# Altium schematic sheet [08] - QSFP28_2.SchDoc: QSFP28 Module
size A3; Engineer: *ORCEL THYS; DocumentNumber: 5; SheetNumber: 5; SheetTotal: 14
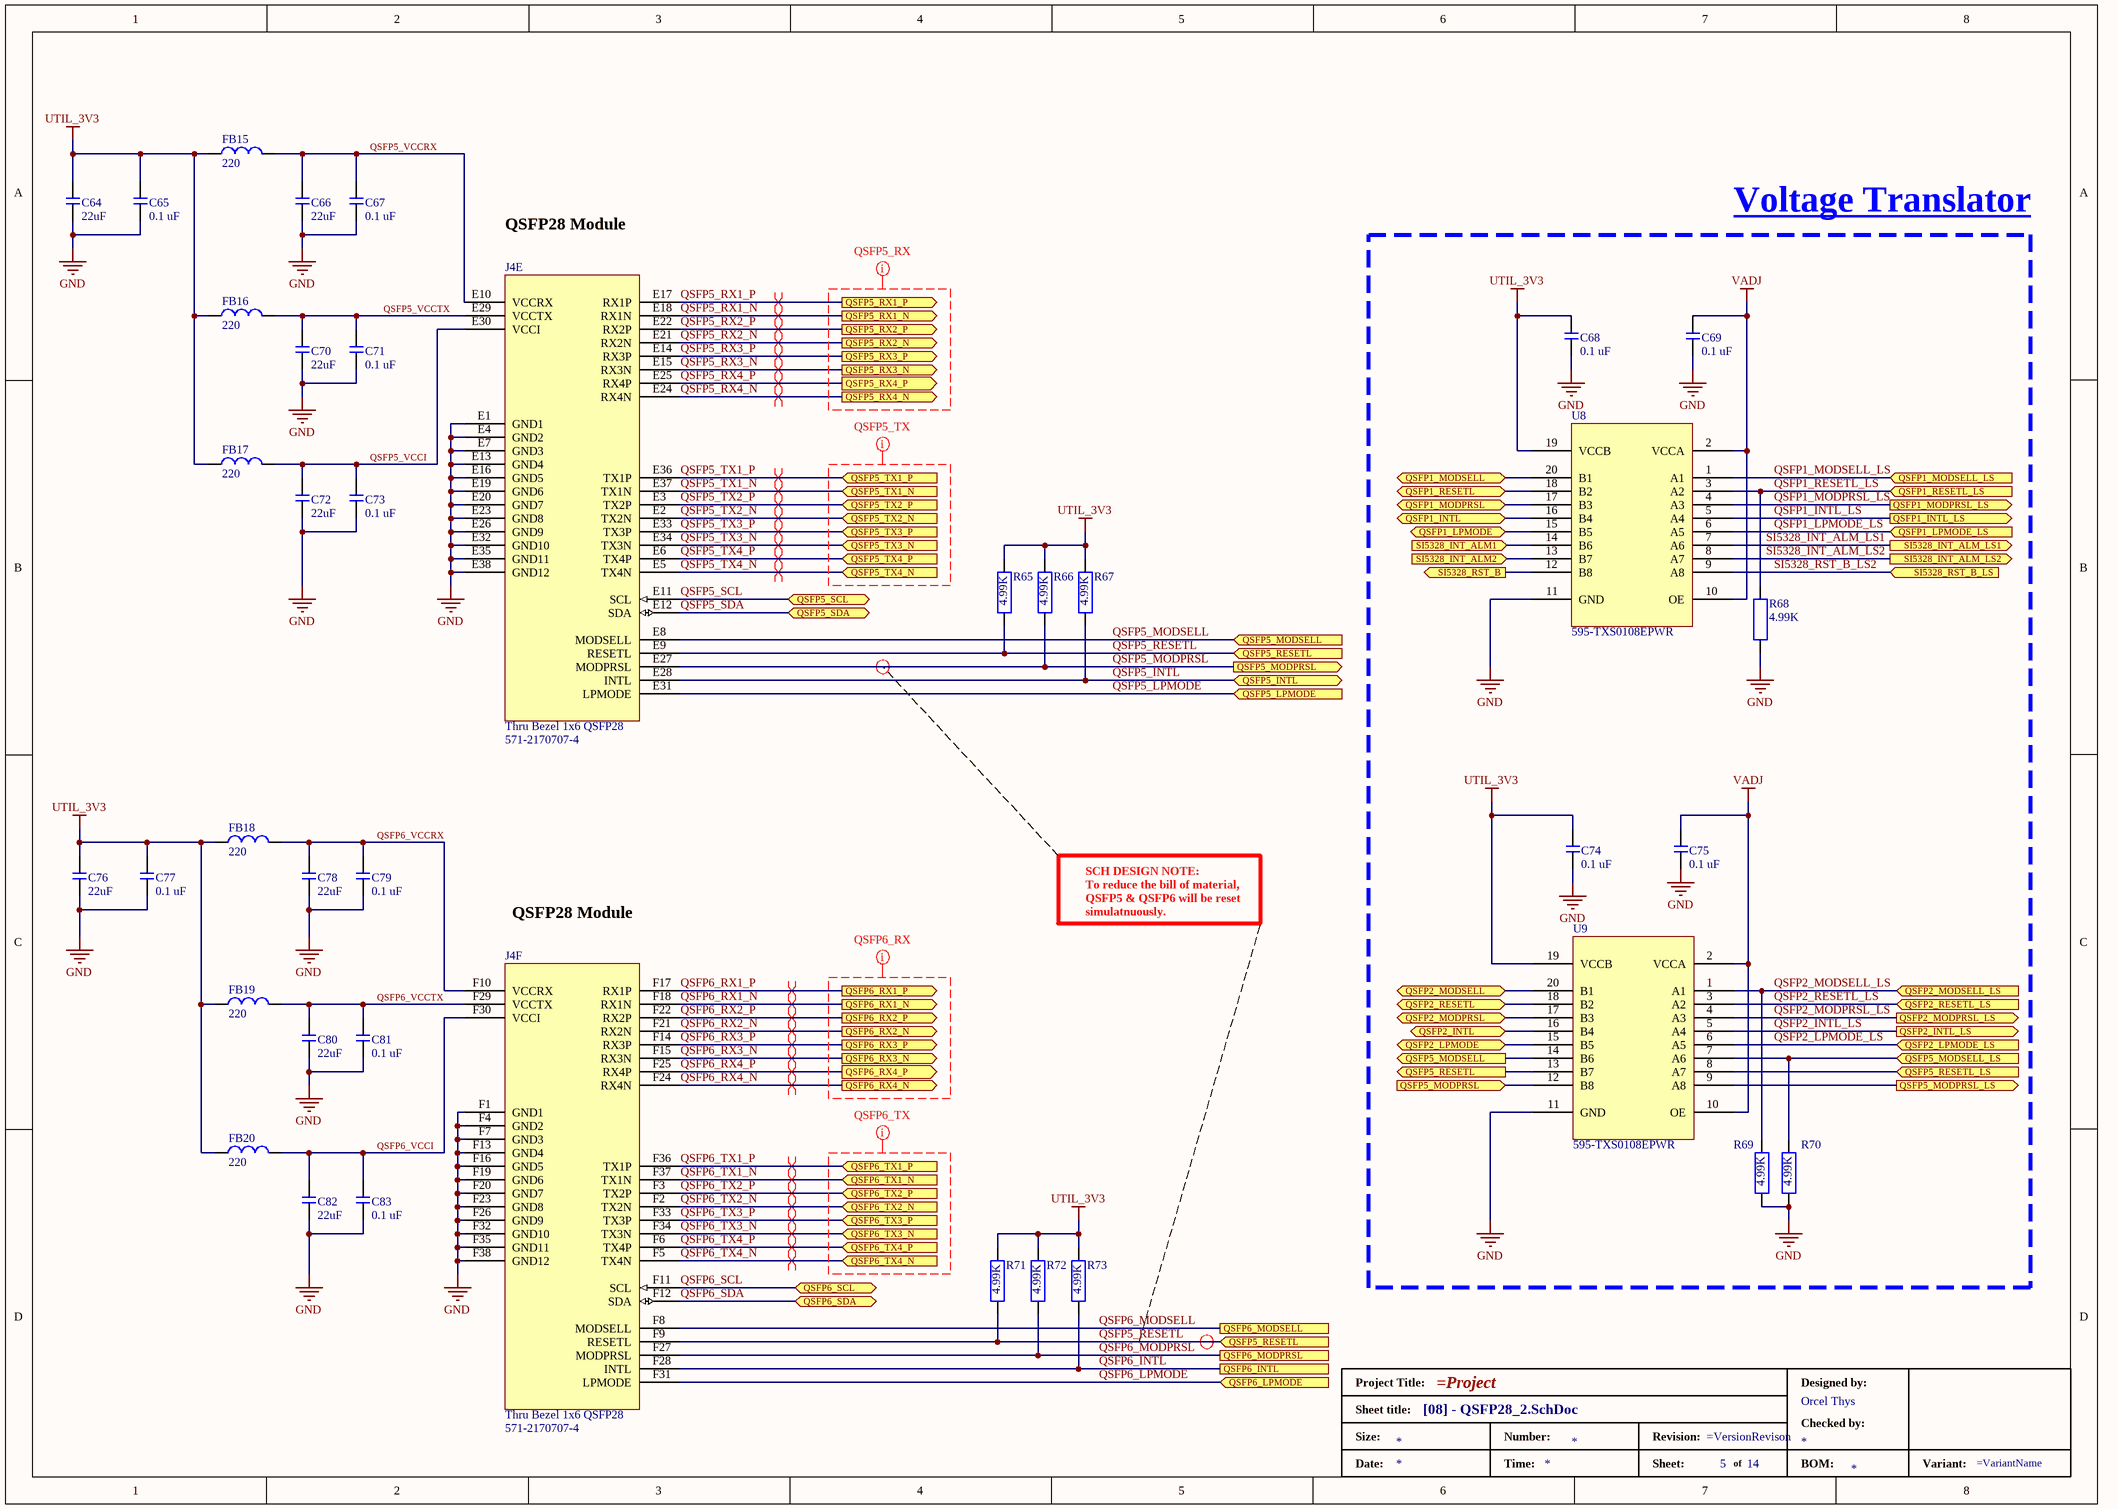
[diagram p0: [08] - QSFP28_2.SchDoc]

## Parts
*  DesignedBy: Orcel Thys  (hidden comment: Standard Title Block)  (graphical)
C64  22uF  [C2012]
C65  0.1 uF  [C0402]
C66  22uF  [C2012]
C67  0.1 uF  [C0402]
C68  0.1 uF  [C0402]
C69  0.1 uF  [C0402]
C70  22uF  [C2012]
C71  0.1 uF  [C0402]
C72  22uF  [C2012]
C73  0.1 uF  [C0402]
C74  0.1 uF  [C0402]
C75  0.1 uF  [C0402]
C76  22uF  [C2012]
C77  0.1 uF  [C0402]
C78  22uF  [C2012]
C79  0.1 uF  [C0402]
C80  22uF  [C2012]
C81  0.1 uF  [C0402]
C82  22uF  [C2012]
C83  0.1 uF  [C0402]
FB15  220  [BEADC1608X75N]
FB16  220  [BEADC1608X75N]
FB17  220  [BEADC1608X75N]
FB18  220  [BEADC1608X75N]
FB19  220  [BEADC1608X75N]
FB20  220  [BEADC1608X75N]
J4  Thru Bezel 1x6 QSFP28  Supplier Part Number 1: 571-2170707-4  [TE_2170707-4]  (parts E,F of 7)
R65  4.99K  [R0402]
R66  4.99K  [R0402]
R67  4.99K  [R0402]
R68  4.99K  [R0402]
R69  4.99K  [R0402]
R70  4.99K  [R0402]
R71  4.99K  [R0402]
R72  4.99K  [R0402]
R73  4.99K  [R0402]
U8  Supplier Part Number 1: 595-TXS0108EPWR  [SOP_65P640X120-20N]  (hidden comment: 8-bit voltage translator)
U9  Supplier Part Number 1: 595-TXS0108EPWR  [SOP_65P640X120-20N]  (hidden comment: 8-bit voltage translator)

## Blocks framed on the sheet
Voltage Translator: C68 C69 C74 C75 R68-R70 U8 U9

## Ports
QSFP1_INTL (bidir), QSFP1_INTL_LS (out), QSFP1_LPMODE (bidir), QSFP1_LPMODE_LS (in), QSFP1_MODPRSL (bidir), QSFP1_MODPRSL_LS (out), QSFP1_MODSELL (bidir), QSFP1_MODSELL_LS (in), QSFP1_RESETL (bidir), QSFP1_RESETL_LS (in), QSFP2_INTL (bidir), QSFP2_INTL_LS (out), QSFP2_LPMODE (bidir), QSFP2_LPMODE_LS (in), QSFP2_MODPRSL (bidir), QSFP2_MODPRSL_LS (out), QSFP2_MODSELL (bidir), QSFP2_MODSELL_LS (in), QSFP2_RESETL (bidir), QSFP2_RESETL_LS (in), QSFP5_INTL (bidir), QSFP5_LPMODE (in), QSFP5_MODPRSL (in), QSFP5_MODPRSL (out), QSFP5_MODPRSL_LS (out), QSFP5_MODSELL (in), QSFP5_MODSELL (out), QSFP5_MODSELL_LS (in), QSFP5_RESETL (in), QSFP5_RESETL (out), QSFP5_RESETL_LS (in), QSFP5_RX1_N (out), QSFP5_RX1_P (out), QSFP5_RX2_N (out), QSFP5_RX2_P (out), QSFP5_RX3_N (out), QSFP5_RX3_P (out), QSFP5_RX4_N (out), QSFP5_RX4_P (out), QSFP5_SCL (bidir), QSFP5_SDA (bidir), QSFP5_TX1_N (in), QSFP5_TX1_P (in), QSFP5_TX2_N (in), QSFP5_TX2_P (in), QSFP5_TX3_N (in), QSFP5_TX3_P (in), QSFP5_TX4_N (in), QSFP5_TX4_P (in), QSFP6_INTL, QSFP6_LPMODE (in), QSFP6_MODPRSL, QSFP6_MODSELL, QSFP6_RX1_N (out), QSFP6_RX1_P (out), QSFP6_RX2_N (out), QSFP6_RX2_P (out), QSFP6_RX3_N (out), QSFP6_RX3_P (out), QSFP6_RX4_N (out), QSFP6_RX4_P (out), QSFP6_SCL (bidir), QSFP6_SDA (bidir), QSFP6_TX1_N (in), QSFP6_TX1_P (in), QSFP6_TX2_N (in), QSFP6_TX2_P (in), QSFP6_TX3_N (in), QSFP6_TX3_P (in), QSFP6_TX4_N (in), QSFP6_TX4_P (in), SI5328_INT_ALM1 (in), SI5328_INT_ALM2 (in), SI5328_INT_ALM_LS1 (out), SI5328_INT_ALM_LS2 (out), SI5328_RST_B (out), SI5328_RST_B_LS (in)

## Nets
GND: C64.1 C65.1 C66.1 C67.1 C68.2 C69.1 C70.1 C71.1 C72.1 C73.1 C74.1 C75.1 C76.1 C77.1 C78.1 C79.1 C80.1 C81.1 C82.1 C83.1 J4.E1(GND1) J4.E4(GND2) J4.E7(GND3) J4.E13(GND4) J4.E16(GND5) J4.E19(GND6) J4.E20(GND7) J4.E23(GND8) J4.E26(GND9) J4.E32(GND10) J4.E35(GND11) J4.E38(GND12) J4.F1(GND1) J4.F4(GND2) J4.F7(GND3) J4.F13(GND4) J4.F16(GND5) J4.F19(GND6) J4.F20(GND7) J4.F23(GND8) J4.F26(GND9) J4.F32(GND10) J4.F35(GND11) J4.F38(GND12) R68.1 R69.1 R70.1 U8.11(GND) U9.11(GND)
UTIL_3V3: C64.2 C65.2 C68.1 C74.2 C76.2 C77.2 FB15.1 FB16.1 FB17.1 FB18.1 FB19.1 FB20.1 R65.2 R66.2 R67.2 R71.2 R72.2 R73.2 U8.19(VCCB) U9.19(VCCB)
VADJ: C69.2 C75.2 U8.2(VCCA) U8.10(OE) U9.2(VCCA) U9.10(OE)
QSFP1_INTL: U8.16(B4) ; port QSFP1_INTL
QSFP1_INTL_LS: U8.5(A4) ; port QSFP1_INTL_LS
QSFP1_LPMODE: U8.15(B5) ; port QSFP1_LPMODE
QSFP1_LPMODE_LS: U8.6(A5) ; port QSFP1_LPMODE_LS
QSFP1_MODPRSL: U8.17(B3) ; port QSFP1_MODPRSL
QSFP1_MODPRSL_LS: U8.4(A3) ; port QSFP1_MODPRSL_LS
QSFP1_MODSELL: U8.20(B1) ; port QSFP1_MODSELL
QSFP1_MODSELL_LS: U8.1(A1) ; port QSFP1_MODSELL_LS
QSFP1_RESETL: U8.18(B2) ; port QSFP1_RESETL
QSFP1_RESETL_LS: R68.2 U8.3(A2) ; port QSFP1_RESETL_LS
QSFP2_INTL: U9.16(B4) ; port QSFP2_INTL
QSFP2_INTL_LS: U9.5(A4) ; port QSFP2_INTL_LS
QSFP2_LPMODE: U9.15(B5) ; port QSFP2_LPMODE
QSFP2_LPMODE_LS: U9.6(A5) ; port QSFP2_LPMODE_LS
QSFP2_MODPRSL: U9.17(B3) ; port QSFP2_MODPRSL
QSFP2_MODPRSL_LS: U9.4(A3) ; port QSFP2_MODPRSL_LS
QSFP2_MODSELL: U9.20(B1) ; port QSFP2_MODSELL
QSFP2_MODSELL_LS: R69.2 U9.1(A1) ; port QSFP2_MODSELL_LS
QSFP2_RESETL: U9.18(B2) ; port QSFP2_RESETL
QSFP2_RESETL_LS: U9.3(A2) ; port QSFP2_RESETL_LS
QSFP5_INTL: J4.E28(INTL) R67.1 ; port QSFP5_INTL
QSFP5_LPMODE: J4.E31(LPMODE) ; port QSFP5_LPMODE
QSFP5_MODPRSL: J4.E27(MODPRSL) R66.1 U9.12(B8) ; port QSFP5_MODPRSL
QSFP5_MODPRSL_LS: U9.9(A8) ; port QSFP5_MODPRSL_LS
QSFP5_MODSELL: J4.E8(MODSELL) U9.14(B6) ; port QSFP5_MODSELL
QSFP5_MODSELL_LS: R70.2 U9.7(A6) ; port QSFP5_MODSELL_LS
QSFP5_RESETL: J4.E9(RESETL) J4.F9(RESETL) R65.1 R71.1 U9.13(B7) ; port QSFP5_RESETL
QSFP5_RESETL_LS: U9.8(A7) ; port QSFP5_RESETL_LS
QSFP5_RX1_N: J4.E18(RX1N) ; port QSFP5_RX1_N
QSFP5_RX1_P: J4.E17(RX1P) ; port QSFP5_RX1_P
QSFP5_RX2_N: J4.E21(RX2N) ; port QSFP5_RX2_N
QSFP5_RX2_P: J4.E22(RX2P) ; port QSFP5_RX2_P
QSFP5_RX3_N: J4.E15(RX3N) ; port QSFP5_RX3_N
QSFP5_RX3_P: J4.E14(RX3P) ; port QSFP5_RX3_P
QSFP5_RX4_N: J4.E24(RX4N) ; port QSFP5_RX4_N
QSFP5_RX4_P: J4.E25(RX4P) ; port QSFP5_RX4_P
QSFP5_SCL: J4.E11(SCL) ; port QSFP5_SCL
QSFP5_SDA: J4.E12(SDA) ; port QSFP5_SDA
QSFP5_TX1_N: J4.E37(TX1N) ; port QSFP5_TX1_N
QSFP5_TX1_P: J4.E36(TX1P) ; port QSFP5_TX1_P
QSFP5_TX2_N: J4.E2(TX2N) ; port QSFP5_TX2_N
QSFP5_TX2_P: J4.E3(TX2P) ; port QSFP5_TX2_P
QSFP5_TX3_N: J4.E34(TX3N) ; port QSFP5_TX3_N
QSFP5_TX3_P: J4.E33(TX3P) ; port QSFP5_TX3_P
QSFP5_TX4_N: J4.E5(TX4N) ; port QSFP5_TX4_N
QSFP5_TX4_P: J4.E6(TX4P) ; port QSFP5_TX4_P
QSFP5_VCCI: C72.2 C73.2 FB17.2 J4.E30(VCCI)
QSFP5_VCCRX: C66.2 C67.2 FB15.2 J4.E10(VCCRX)
QSFP5_VCCTX: C70.2 C71.2 FB16.2 J4.E29(VCCTX)
QSFP6_INTL: J4.F28(INTL) R73.1 ; port QSFP6_INTL
QSFP6_LPMODE: J4.F31(LPMODE) ; port QSFP6_LPMODE
QSFP6_MODPRSL: J4.F27(MODPRSL) R72.1 ; port QSFP6_MODPRSL
QSFP6_MODSELL: J4.F8(MODSELL) ; port QSFP6_MODSELL
QSFP6_RX1_N: J4.F18(RX1N) ; port QSFP6_RX1_N
QSFP6_RX1_P: J4.F17(RX1P) ; port QSFP6_RX1_P
QSFP6_RX2_N: J4.F21(RX2N) ; port QSFP6_RX2_N
QSFP6_RX2_P: J4.F22(RX2P) ; port QSFP6_RX2_P
QSFP6_RX3_N: J4.F15(RX3N) ; port QSFP6_RX3_N
QSFP6_RX3_P: J4.F14(RX3P) ; port QSFP6_RX3_P
QSFP6_RX4_N: J4.F24(RX4N) ; port QSFP6_RX4_N
QSFP6_RX4_P: J4.F25(RX4P) ; port QSFP6_RX4_P
QSFP6_SCL: J4.F11(SCL) ; port QSFP6_SCL
QSFP6_SDA: J4.F12(SDA) ; port QSFP6_SDA
QSFP6_TX1_N: J4.F37(TX1N) ; port QSFP6_TX1_N
QSFP6_TX1_P: J4.F36(TX1P) ; port QSFP6_TX1_P
QSFP6_TX2_N: J4.F2(TX2N) ; port QSFP6_TX2_N
QSFP6_TX2_P: J4.F3(TX2P) ; port QSFP6_TX2_P
QSFP6_TX3_N: J4.F34(TX3N) ; port QSFP6_TX3_N
QSFP6_TX3_P: J4.F33(TX3P) ; port QSFP6_TX3_P
QSFP6_TX4_N: J4.F5(TX4N) ; port QSFP6_TX4_N
QSFP6_TX4_P: J4.F6(TX4P) ; port QSFP6_TX4_P
QSFP6_VCCI: C82.2 C83.2 FB20.2 J4.F30(VCCI)
QSFP6_VCCRX: C78.2 C79.2 FB18.2 J4.F10(VCCRX)
QSFP6_VCCTX: C80.2 C81.2 FB19.2 J4.F29(VCCTX)
SI5328_INT_ALM1: U8.14(B6) ; port SI5328_INT_ALM1
SI5328_INT_ALM2: U8.13(B7) ; port SI5328_INT_ALM2
SI5328_INT_ALM_LS1: U8.7(A6) ; port SI5328_INT_ALM_LS1
SI5328_INT_ALM_LS2: U8.8(A7) ; port SI5328_INT_ALM_LS2
SI5328_RST_B: U8.12(B8) ; port SI5328_RST_B
SI5328_RST_B_LS2: U8.9(A8) ; port SI5328_RST_B_LS

## Layout directives
mark named QSFP5_RX: (no net found under the mark)
mark named QSFP5_TX: (no net found under the mark)
mark named QSFP6_RX: (no net found under the mark)
mark named QSFP6_TX: (no net found under the mark)
differential pair: QSFP5_RX1_N, QSFP5_RX1_P, QSFP5_RX2_N, QSFP5_RX2_P, QSFP5_RX3_N, QSFP5_RX3_P, QSFP5_RX4_N, QSFP5_RX4_P, QSFP5_TX1_N, QSFP5_TX1_P, QSFP5_TX2_N, QSFP5_TX2_P, QSFP5_TX3_N, QSFP5_TX3_P, QSFP5_TX4_N, QSFP5_TX4_P, QSFP6_RX1_N, QSFP6_RX1_P, QSFP6_RX2_N, QSFP6_RX2_P, QSFP6_RX3_N, QSFP6_RX3_P, QSFP6_RX4_N, QSFP6_RX4_P, QSFP6_TX1_N, QSFP6_TX1_P, QSFP6_TX2_N, QSFP6_TX2_P, QSFP6_TX3_N, QSFP6_TX3_P, QSFP6_TX4_N, QSFP6_TX4_P

## Notes on the sheet
- QSFP28 Module
- SCH DESIGN NOTE:
  To reduce the bill of material, QSFP5 & QSFP6 will be reset simulatnuously.
- Title
- Size:
- Date:
- A4
- Number:
- Time:
- Revision:
- Sheet
- of
- File:
- (in symbol Title_Block) Project Title:; Designed by:; Sheet title:; Checked by:; Size:; Number:; Revision:; Date:; Time:; Sheet:; of; BOM:; Variant:

## Library data of the parts
* = Title_Block: Size: *; BOM: *; DW: *; CheckedBy: *
C64 C66 C70 C72 C76 C78 C80 C82 = C2012X5R1V226M125AC: Cap Series 0805 22 uF 35 V ±20 % Tolerance X5R SMT Multilayer Ceramic Capacitor; Manufacturer: TDK; Tolerance: 20%; Voltage Rating: 35V; Supplier 1: Rs; Manufacturer Part Number: C2012X5R1V226M125AC; RoHS: Yes; Category: Ceramic Capacitors; Stock 1: 15560; Pricing 1: 50=0.544, 100=0.502, 250=0.458, 500=0.418 (EUR); Mount: Surface Mount; Case/Package: 0805; Case Code (Metric): 2012; Case Code (Imperial): 0805; Weight: 0.000194oz; Dielectric Material: Ceramic; Min Operating Temperature: -55°C; Max Operating Temperature: 85°C; Package Quantity: 1; Packaging: Tape and Reel; Capacitance: 22uF; Dielectric: X5R; Termination: SMD/SMT; Voltage Rating (DC): 35V; Series: C; Length: 0.079inch; Width: 0.049inch; Height: 1.25mm; Thickness: 0.057inch; Reach SVHC Compliant: No; Lead Free: Lead Free; RoHS Compliant: Yes; ComponentLink1URL: https://datasheet.ciiva.com/14893/tdkmlcccaprange-14893109.pdf?src-supplier=Digi-Key; ComponentLink1Description: https://datasheet.ciiva.com/14893/tdkmlcccaprange-14893109.pdf?src-supplier=Digi-Key; ComponentLink2URL: https://datasheet.ciiva.com/14893/tdkmlcccaprange-14893110.pdf?src-supplier=Digi-Key; ComponentLink2Description: https://datasheet.ciiva.com/14893/tdkmlcccaprange-14893110.pdf?src-supplier=Digi-Key; ComponentLink3URL: https://datasheet.ciiva.com/14893/tdkmlcccaprange-14893111.pdf?src-supplier=Digi-Key; ComponentLink3Description: https://datasheet.ciiva.com/14893/tdkmlcccaprange-14893111.pdf?src-supplier=Digi-Key; Supplier Part Number 1: 9159334P
C65 C67-C69 C71 C73-C75 C77 C79 C81 C83 = UMK105B7104KV-FR: Cap 0402 0.1 uF 50 V ±10 % Tolerance X7R Surface Mount Multilayer Ceramic Capacitor; Manufacturer: Taiyo Yuden; Voltage Rating: 50V; Capacitance: 100nF; Tolerance: 10%; Supplier 1: Rs; Manufacturer Part Number: UMK105B7104KV-FR; RoHS: Yes; Category: Ceramic Capacitors; Stock 1: 60000; Pricing 1: 10000=0.016 (EUR); Mount: Surface Mount; Case/Package: 0402; Case Code (Imperial): 0402; Case Code (Metric): 1005; Min Operating Temperature: -55°C; Max Operating Temperature: 125°C; Voltage Rating (DC): 50V; Packaging: Tape and Reel; Package Quantity: 1; Dielectric: X7R; Termination: SMD/SMT; Series: M; Length: 0.039inch; Width: 0.02inch; Height: 0.5mm; Thickness: 0.022inch; Lead Free: Lead Free; Halogen Free: Halogen Free; RoHS Compliant: Yes; ComponentLink1URL: https://datasheet.ciiva.com/24356/619umk105b7104kv-fr-24356845.pdf?src-supplier=Onlinecomponents.com; ComponentLink1Description: https://datasheet.ciiva.com/24356/619umk105b7104kv-fr-24356845.pdf?src-supplier=Onlinecomponents.com; ComponentLink2URL: https://datasheet.ciiva.com/30180/52umk105b7104kv-fr-30180098.pdf?src-supplier=Onlinecomponents.com; ComponentLink2Description: https://datasheet.ciiva.com/30180/52umk105b7104kv-fr-30180098.pdf?src-supplier=Onlinecomponents.com; ComponentLink3URL: https://datasheet.ciiva.com/18697/mlcc-all-e-18697452.pdf?src-supplier=Digi-Key; ComponentLink3Description: https://datasheet.ciiva.com/18697/mlcc-all-e-18697452.pdf?src-supplier=Digi-Key; ComponentLink4URL: https://datasheet.ciiva.com/18697/mlcc-all-e-18697451.pdf?src-supplier=Digi-Key; ComponentLink4Description: https://datasheet.ciiva.com/18697/mlcc-all-e-18697451.pdf?src-supplier=Digi-Key; ComponentLink5URL: https://datasheet.ciiva.com/18697/mlcc-all-e-18697453.pdf?src-supplier=Digi-Key; ComponentLink5Description: https://datasheet.ciiva.com/18697/mlcc-all-e-18697453.pdf?src-supplier=Digi-Key; Supplier Part Number 1: 1782869
FB15-FB20 = MPZ1608S221ATA00: 0603 220Ω ±25% DCR=0.050Ω 2.2A; Manufacturer: TDK; Core Material: Ferrite; Impedance: 220R; DC Resistance (DCR): 50mR; Number of Lines: 1; Supplier 1: Farnell; Manufacturer Part Number: MPZ1608S221ATA00; RoHS: Yes; Category: Ferrite Beads and Chips; Stock 1: 256000; Pricing 1: 4000=0.0235, 20000=0.023, 40000=0.0226 (EUR); Mount: Surface Mount; Case/Package: 0603; Number of Pins: 2; Case Code (Imperial): 0603; Case Code (Metric): 1608; Tolerance: 25%; Packaging: Cut Tape; Package Quantity: 1; Max DC Current: 2.2A; Series: MPZ; Current Rating: 2.2A; Max Current Rating: 2.2A; Length: 0.063inch; Width: 0.031inch; Height: 0.037inch; RoHS Compliant: Yes; Lead Free: Lead Free; Reach SVHC Compliant: No; ComponentLink1URL: https://datasheet.ciiva.com/8077/55167-8077073.pdf?src-supplier=Element14; ComponentLink1Description: https://datasheet.ciiva.com/8077/55167-8077073.pdf?src-supplier=Element14; ComponentLink2URL: https://datasheet.ciiva.com/8077/55167-8077071.pdf?src-supplier=Element14; ComponentLink2Description: https://datasheet.ciiva.com/8077/55167-8077071.pdf?src-supplier=Element14; ComponentLink3URL: https://datasheet.ciiva.com/46381/1486324-46381628.pdf?src-supplier=Element14; ComponentLink3Description: https://datasheet.ciiva.com/46381/1486324-46381628.pdf?src-supplier=Element14; ComponentLink4URL: https://datasheet.ciiva.com/46366/print-detail-pdf-phplangenpart-nompz1608s221ata00nreimp-unit-xmhz-46366044.pdf?src-supplier=Onlinecomponents.com; ComponentLink4Description: https://datasheet.ciiva.com/46366/print-detail-pdf-phplangenpart-nompz1608s221ata00nreimp-unit-xmhz-46366044.pdf?src-supplier=Onlinecomponents.com; Supplier Part Number 1: 2800773
J4 = 2170707-4: Cage Assy, 1X6, QSFP28, Spring, Hs; Manufacturer: TE Connectivity AMP; Supplier 1: Mouser; Manufacturer Part Number: 2170707-4; RoHS: Yes; Category: Connectors; Stock 1: 60; Pricing 1: 1=80.77, 10=80.77, 50=71.27, 100=70.28, 1000=67.22, 10000=67.22 (USD); ComponentLink1URL: https://www.te.com/commerce/DocumentDelivery/DDEController?Action=srchrtrv&DocNm=2170707&DocType=Customer+Drawing&DocLang=English&src-supplier=Digi-Key; ComponentLink1Description: https://www.te.com/commerce/DocumentDelivery/DDEController?Action=srchrtrv&DocNm=2170707&DocType=Customer+Drawing&DocLang=English&src-supplier=Digi-Key
R65-R73 = ERJ-2RKF4991X: RES SMD 4.99K OHM 1% 1/10W 0402; Manufacturer: Panasonic; Resistance: 4.99kR; Power Rating: 100mW; Voltage Rating: 50V; Temperature Coefficient: 100ppm/°C; Supplier 1: Mouser; Manufacturer Part Number: ERJ-2RKF4991X; RoHS: Yes; Category: Chip SMD Resistors; Stock 1: 1218727; Pricing 1: 1=0.1, 10=0.018, 50=0.018, 100=0.008, 1000=0.006, 10000=0.004 (USD); Mount: Surface Mount; Case/Package: 0402; Case Code (Metric): 1005; Case Code (Imperial): 0402; Contact Plating: Tin; Weight: 2.8E-05oz; Min Operating Temperature: -55°C; Max Operating Temperature: 155°C; Tolerance: 1%; Packaging: Tape and Reel; Package Quantity: 1; Resistor Type: Thick Film; Number of Terminations: 2; Termination: SMD/SMT; Max Power Dissipation: 100mW; Voltage Rating (DC): 50V; Features: Automotive AEC-Q200; Series: ERJ; Resistance Tolerance: 1%; Construction: Rectangular; Working Voltage: 50V; Technology: THICK FILM; Length: 1mm; Width: 0.5mm; Height: 0.016inch; Depth: 0.5mm; Radiation Hardening: No; Reach SVHC Compliant: No; Military Standard: Not; Lead Free: Lead Free; RoHS Compliant: Yes; ComponentLink1URL: https://datasheet.ciiva.com/46388/426256-46388311.pdf?src-supplier=Element14; ComponentLink1Description: https://datasheet.ciiva.com/46388/426256-46388311.pdf?src-supplier=Element14; ComponentLink2URL: https://datasheet.ciiva.com/46376/426256-46376955.pdf?src-supplier=Element14; ComponentLink2Description: https://datasheet.ciiva.com/46376/426256-46376955.pdf?src-supplier=Element14; ComponentLink3URL: https://datasheet.ciiva.com/22749/1678782-22749654.pdf?src-supplier=Element14; ComponentLink3Description: https://datasheet.ciiva.com/22749/1678782-22749654.pdf?src-supplier=Element14; ComponentLink4URL: https://datasheet.ciiva.com/24158/aoa0000ce2-24158871.pdf?src-supplier=Mouser; ComponentLink4Description: https://datasheet.ciiva.com/24158/aoa0000ce2-24158871.pdf?src-supplier=Mouser; ComponentLink5URL: https://datasheet.ciiva.com/16775/70260748-16775018.pdf?src-supplier=Allied+Electronics; ComponentLink5Description: https://datasheet.ciiva.com/16775/70260748-16775018.pdf?src-supplier=Allied+Electronics; ComponentLink6URL: https://datasheet.ciiva.com/16773/70260748-16773110.pdf?src-supplier=Allied+Electronics; ComponentLink6Description: https://datasheet.ciiva.com/16773/70260748-16773110.pdf?src-supplier=Allied+Electronics; ComponentLink7URL: https://datasheet.ciiva.com/16199/aoa0000ce2-16199546.pdf?src-supplier=Future+Electronics; ComponentLink7Description: https://datasheet.ciiva.com/16199/aoa0000ce2-16199546.pdf?src-supplier=Future+Electronics; Supplier Part Number 1: 667-ERJ-2RKF4991X
U8 U9 = TXS0108EPWR: IC 8BIT NON-INV TRANSLTR 20TSSOP; Manufacturer: Texas Instruments; Data Rate: 60Mbps; Number of Bits: 8; Propagation Delay: 4.8ns; Min Supply Voltage: 1.2V; Max Supply Voltage: 5.5V; High Level Output Current: -50mA; Low Level Output Current: 50mA; Turn-On Delay Time: 312ns; Quiescent Current: 3uA; Channel Type: Bidirectional; Number of Circuits: 1; Output Current: 620uA; Rise Time: 6.3ns; Supply Current: 8uA; Supplier 1: Mouser; Manufacturer Part Number: TXS0108EPWR; RoHS: Yes; Category: Voltage Level Shifters; Stock 1: 220045; Pricing 1: 1=1.57, 10=1.41, 50=1.33, 100=1.13, 1000=0.772, 10000=0.702 (USD); Mount: Surface Mount; Case/Package: TSSOP; Number of Pins: 20; Weight: 0.002716oz; Min Operating Temperature: -40°C; Max Operating Temperature: 85°C; Packaging: Tape and Reel; Series: -; Number of Channels: 8; Logic Function: Translator; Number of Inputs: 8; Package Quantity: 2000; Termination: SMD/SMT; Radiation Hardening: No; Lead Free: Lead Free; RoHS Compliant: Yes; Reach SVHC Compliant: No; ComponentLink1URL: https://datasheet.ciiva.com/14287/txs0108e-14287280.pdf?src-supplier=Farnell; ComponentLink1Description: https://datasheet.ciiva.com/14287/txs0108e-14287280.pdf?src-supplier=Farnell; ComponentLink2URL: https://datasheet.ciiva.com/28653/1714661-28653429.pdf?src-supplier=Element14; ComponentLink2Description: https://datasheet.ciiva.com/28653/1714661-28653429.pdf?src-supplier=Element14; ComponentLink3URL: https://datasheet.ciiva.com/4834/sces642b-127094-4834401.pdf?src-supplier=Mouser; ComponentLink3Description: https://datasheet.ciiva.com/4834/sces642b-127094-4834401.pdf?src-supplier=Mouser; ComponentLink4URL: https://datasheet.ciiva.com/15096/getdatasheetpartid-322119-15096276.pdf?src-supplier=Verical; ComponentLink4Description: https://datasheet.ciiva.com/15096/getdatasheetpartid-322119-15096276.pdf?src-supplier=Verical; ComponentLink5URL: https://datasheet.ciiva.com/1508/1815244-1508732.pdf?src-supplier=Element14; ComponentLink5Description: https://datasheet.ciiva.com/1508/1815244-1508732.pdf?src-supplier=Element14; ComponentLink6URL: https://datasheet.ciiva.com/1899/txs0108e-1899605.pdf?src-supplier=Digi-Key; ComponentLink6Description: https://datasheet.ciiva.com/1899/txs0108e-1899605.pdf?src-supplier=Digi-Key; ComponentLink7URL: https://datasheet.ciiva.com/1899/txs0108e-1899604.pdf?src-supplier=Digi-Key; ComponentLink7Description: https://datasheet.ciiva.com/1899/txs0108e-1899604.pdf?src-supplier=Digi-Key; ComponentLink8URL: https://datasheet.ciiva.com/1899/txs0108e-1899606.pdf?src-supplier=Digi-Key; ComponentLink8Description: https://datasheet.ciiva.com/1899/txs0108e-1899606.pdf?src-supplier=Digi-Key; ComponentLink9URL: https://datasheet.ciiva.com/14287/txs0108e-14287532.pdf?src-supplier=Avnet; ComponentLink9Description: https://datasheet.ciiva.com/14287/txs0108e-14287532.pdf?src-supplier=Avnet